# EAGLE design The_X_Project (EAGLE 6.1)
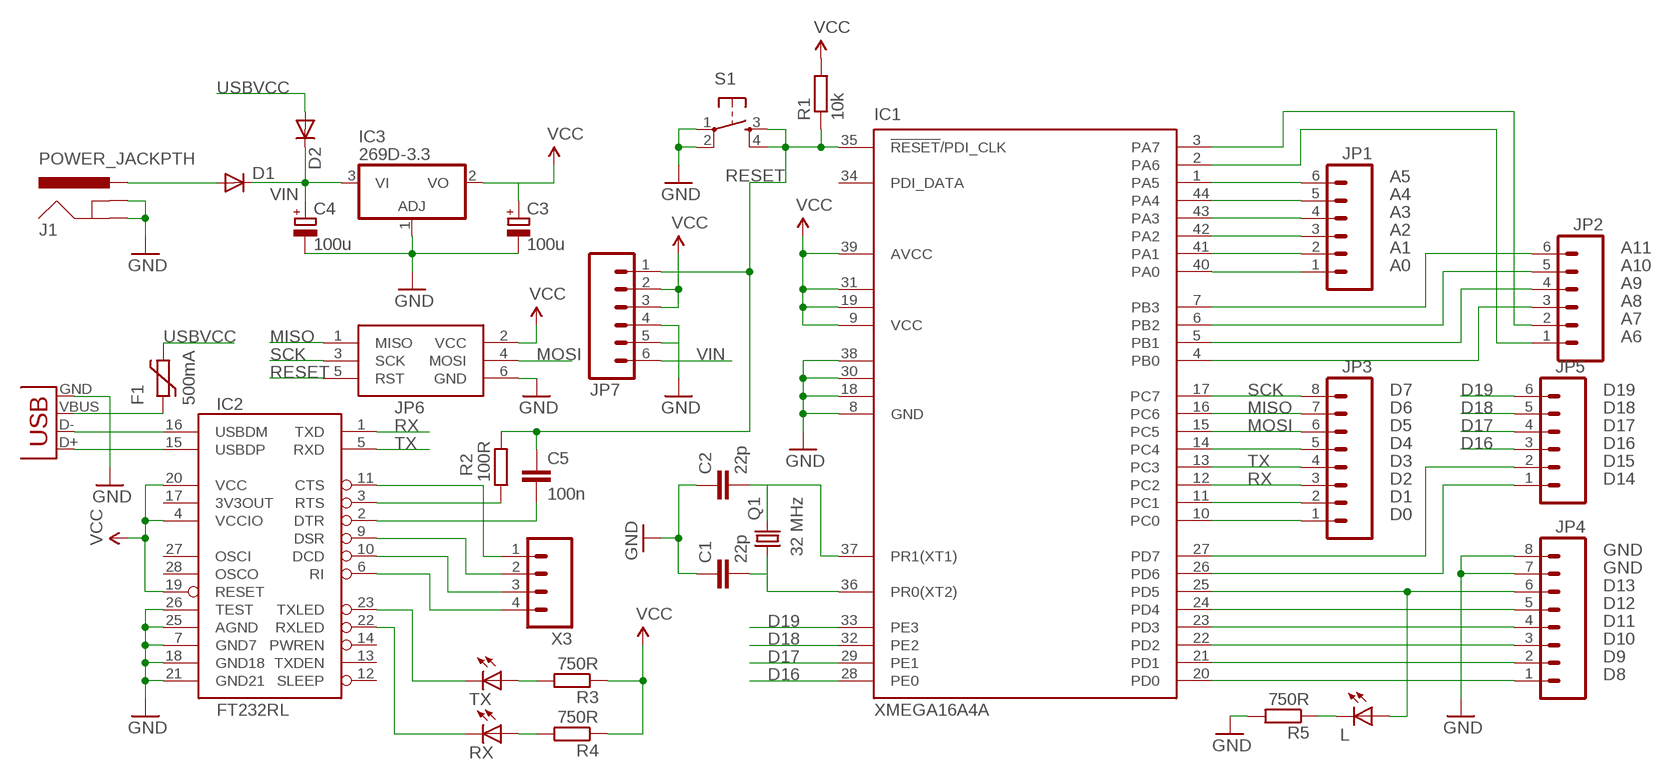
[diagram p0: schematic, sheet 1]

## Parts
C1  22p  C-EUC0805  [C0805]
C2  22p  C-EUC0805  [C0805]
C3  100u  CPOL-EUD  [PANASONIC_D]
C4  100u  CPOL-EUD  [PANASONIC_D]
C5  100n  C-EUC0805  [C0805]
D1  DIODE-SMB  [SMB]
D2  DIODE-SMB  [SMB]
F1  500mA  1812L  [1812L]
IC1  XMEGA16A4A  [TQFP44]
IC2  FT232RL  FT232RLSSOP  [SSOP28DB]
IC3  269D-3.3  MC33269D-3.3  [DPACK]
J1  POWER_JACKPTH  [POWER_JACK_PTH]
JP1  M06SIP  [1X06]
JP2  M06SIP  [1X06]
JP3  M08  [1X08]
JP4  M08  [1X08]
JP5  M06SIP  [1X06]
JP6  AVRISP-6  [AVRISP]
JP7  M06SIP  [1X06]
L  LED1206  [LED-1206]
Q1  32 MHz  CRYSTALHC49U-LM  [HC49U-LM]
R1  10k  R-EU_R0805  [R0805]
R2  100R  R-EU_R0805  [R0805]
R3  750R  R-EU_R0805  [R0805]
R4  750R  R-EU_R0805  [R0805]
R5  750R  R-EU_R0805  [R0805]
RX  LED1206  [LED-1206]
S1  TAC_SWITCHPTH  [TACTILE-PTH]
TX  LED1206  [LED-1206]
X1  USBSMD  [USB-MINIB]
X3  M04PTH  [1X04]

## Nets
D16: IC1.28(PE0) JP5.3
D17: IC1.29(PE1) JP5.4
D18: IC1.32(PE2) JP5.5
D19: IC1.33(PE3) JP5.6
GND: C1.1 C2.1 C3.- C4.- IC1.8(GND) IC1.18(GND1) IC1.30(GND2) IC1.38(GND3) IC2.7(GND7) IC2.18(GND18) IC2.21(GND21) IC2.25(AGND) IC2.26(TEST) IC3.1(ADJ) J1.GND J1.GNDBREAK JP4.7 JP4.8 JP6.6(GND) JP7.4 JP7.5 R5.2 S1.1 S1.2 X1.GND
MISO: IC1.16(PC6) JP3.7 JP6.1(MISO)
MOSI: IC1.15(PC5) JP3.6 JP6.4(MOSI)
N$1: IC1.4(PB0) JP2.3
N$2: IC1.41(PA1) JP1.2
N$3: IC1.42(PA2) JP1.3
N$4: IC1.43(PA3) JP1.4
N$5: IC1.44(PA4) JP1.5
N$6: IC1.1(PA5) JP1.6
N$7: IC1.2(PA6) JP2.1
N$8: IC1.3(PA7) JP2.2
N$9: IC1.5(PB1) JP2.4
N$10: IC1.6(PB2) JP2.5
N$11: IC1.7(PB3) JP2.6
N$12: IC1.10(PC0) JP3.1
N$13: IC1.11(PC1) JP3.2
N$14: IC2.15(USBDP) X1.D+
N$15: IC2.16(USBDM) X1.D-
N$16: IC1.14(PC4) JP3.5
N$20: IC1.20(PD0) JP4.1
N$21: IC1.21(PD1) JP4.2
N$22: IC1.22(PD2) JP4.3
N$23: IC1.23(PD3) JP4.4
N$24: IC1.24(PD4) JP4.5
N$25: IC1.25(PD5) JP4.6 L.A
N$26: IC1.26(PD6) JP5.1
N$27: IC1.27(PD7) JP5.2
N$29: IC1.40(PA0) JP1.1
N$30: D1.A J1.PWR
N$31: F1.P$1 X1.VBUS
N$32: C1.2 IC1.36(PR0(XT2)) Q1.1
N$33: C2.2 IC1.37(PR1(XT1)) Q1.2
N$34: IC2.3(RTS) R2.1
N$36: C5.2 IC2.2(DTR)
N$37: IC2.6(RI) X3.4
N$38: IC2.10(DCD) X3.3
N$39: IC2.9(DSR) X3.2
N$40: IC2.11(CTS) X3.1
N$41: IC2.22(RXLED) RX.C
N$42: IC2.23(TXLED) TX.C
N$43: R4.2 RX.A
N$44: R3.2 TX.A
N$45: L.C R5.1
RESET: C5.1 IC1.35(!RESET!/PDI_CLK) JP6.5(RST) JP7.1 R1.1 R2.2 S1.3 S1.4
RX: IC1.12(PC2) IC2.1(TXD) JP3.3
SCK: IC1.17(PC7) JP3.8 JP6.3(SCK)
TX: IC1.13(PC3) IC2.5(RXD) JP3.4
USBVCC: D2.A F1.P$2
VCC: C3.+ IC1.9(VCC) IC1.19(VCC1) IC1.31(VCC2) IC1.39(AVCC) IC2.4(VCCIO) IC2.19(RESET) IC2.20(VCC) IC3.2(VO) JP6.2(VCC) JP7.2 JP7.3 R1.2 R3.1 R4.1
VIN: C4.+ D1.C D2.C IC3.3(VI) JP7.6
Unconnected: IC1.34(PDI_DATA) IC2.12(SLEEP) IC2.13(TXDEN) IC2.14(PWREN) IC2.17(3V3OUT) IC2.27(OSCI) IC2.28(OSCO)

## Notes on the sheet
- A5
- A4
- A3
- A2
- A1 | A11
- A0 | A10
- A9
- A8
- A7
- A6
- D7 | D19
- D6 | D18
- D5 | D17
- D4 | D16
- D3 | D15
- D2 | D14
- D1
- D0
- GND
- GND
- D13
- D12
- D11
- D10
- D9
- D8

## Library data of the parts
C1 C2 C5 = rcl:C-EU: CAPACITOR, European symbol
C3 C4 = rcl:CPOL-EU: POLARIZED CAPACITOR, European symbol
D1 D2 = diode:DIODE-: DIODE
F1 = ptc-littlefuse:1812L
IC1 = atmel:XMEGA16A4: MICROCONTROLLER Features High-performance, Low-power 8/16-bit AVR XMEGA Microcontroller Non-Volatile Program and Data Memories - 16 KB - 128 KB of In-System Self-Programmable Flash - 4 KB - 8 KB Boot Code Section with Independent Lock Bits - 1 KB - 2 KB EEPROM - 2 KB - 8 KB Internal SRAM Peripheral Features - Four-channel DMA Controller with support for external requests - Eight-channel Event System - Five 16-bit Timer/Counters Three Timer/Counters with 4 Output Compare or Input Capture channels Two Timer/Counters with 2 Output Compare or Input Capture channels High-Resolution Extensions on all Timer/Counters Advanced Waveform Extension on one Timer/Counter - Five USARTs IrDA Extension on one USART - Two Two-Wire Interfaces with dual address match (I2C and SMBus compatible) - Two SPIs (Serial Peripheral Interfaces) peripherals - AES and DES Crypto Engine - 16-bit Real Time Counter with Separate Oscillator - One Twelve-channel, 12-bit, 2 Msps Analog to Digital Converter - One Two-channel, 12-bit, 1 Msps Digital to Analog Converter - Two Analog Comparators with Window compare function - External Interrupts on all General Purpose I/O pins - Programmable Watchdog Timer with Separate On-chip Ultra Low Power Oscillator Special Microcontroller Features - Power-on Reset and Programmable Brown-out Detection - Internal and External Clock Options with PLL - Programmable Multi-level Interrupt Controller - Sleep Modes: Idle, Power-down, Standby, Power-save, Extended Standby - Advanced Programming, Test and Debugging Interfaces PDI (Program and Debug Interface) for programming, test and debugging I/O and Packages - 34 Programmable I/O Lines - 44 - lead TQFP - 44 - pad VQFN/QFN - 49 - ball VFBGA Operating Voltage - 1.6 - 3.6V Speed performance - 0 - 12 MHz @ 1.6 - 3.6V - 0 - 32 MHz @ 2.7 - 3.6V Drawn by Dipl.-Ing. (FH) Robert Siegler Created: 27.05.09; OC_FARNELL: unknown; OC_NEWARK: unknown
IC2 = SparkFun:FT232RL: USB UART FT232RL 4th Generation USB UART (USB <-> Serial) Controller. Spark Fun Electronics SKU : COM-00650
IC3 = linear:MC33269?*: Adjustable Output Low Dropout Voltage Regulator 800 mA Source: http://www.onsemi.com/pub/Collateral/MC33269-D.PDF
J1 = SparkFun:POWER_JACK: Power Jack This is the standard 5.5mm barrel jack for power. The PTH is the most common, proven, reliable, footprint. All others are experimental. The Slot footprint only works if the mill layer is transmitted to the PCB fab house so be warned. Spark Fun Electronics SKU : PRT-00119. Mating wall wart : TOL-00298 (and others)
JP1 JP2 JP5 JP7 = SparkFun:M06: Header 6 Standard 6-pin 0.1" header. Use with straight break away headers (SKU : PRT-00116), right angle break away headers (PRT-00553), swiss pins (PRT-00743), machine pins (PRT-00117), and female headers (PRT-00115). Molex polarized connector foot print use with SKU : PRT-08094 with associated crimp pins and housings. NOTES ON THE VARIANTS LOCK and LOCK_LONGPADS... This footprint was designed to help hold the alignment of a through-hole component (i.e. 6-pin header) while soldering it into place. You may notice that each hole has been shifted either up or down by 0.005 of an inch from it's more standard position (which is a perfectly straight line). This slight alteration caused the pins (the squares in the middle) to touch the edges of the holes. Because they are alternating, it causes a "brace" to hold the component in place. 0.005 has proven to be the perfect amount of "off-center" position when using our standard breakaway headers. Although looks a little odd when you look at the bare footprint, once you have a header in there, the alteration is very hard to notice. Also, if you push a header all the way into place, it is covered up entirely on the bottom side. This idea of altering the position of holes to aid alignment will be further integrated into the Sparkfun Library for other footprints. It can help hold any component with 3 or more connection pins.
JP3 JP4 = SparkFun:M08: Header 8 Standard 8-pin 0.1" header. Use with straight break away headers (SKU : PRT-00116), right angle break away headers (PRT-00553), swiss pins (PRT-00743), machine pins (PRT-00117), and female headers (PRT-00115).
JP6 = adafruit:AVRISP: AVR ISP HEADER Standard 6 pin header for AVR programming
L RX TX = SparkFun:LED: LEDs Standard schematic elements and footprints for 5mm, 3mm, 1206, and 0603 sized LEDs. 5mm - Spark Fun Electronics SKU : COM-00529 (and others)
Q1 = crystal:CRYSTAL: CRYSTAL; OC_FARNELL: 1666956; OC_NEWARK: unknown
R1-R5 = rcl:R-EU_: RESISTOR, European symbol
S1 = SparkFun:TAC_SWITCH: Momentary Switch Button commonly used for reset or general input. Spark Fun Electronics SKU : COM-00097
X1 = SparkFun:USB: USB Connectors USB-B-PTH is fully proven SKU : PRT-00139 USB-miniB is fully proven SKU : PRT-00587 USB-A-PCB is untested. USB-A-H is throughly reviewed, but untested. Spark Fun Electronics SKU : PRT-00437 USB-B-SMT is throughly reviewed, but untested. Needs silkscreen touching up. USB-A-S has not been used/tested USB-MB-H has not been used/tested
X3 = SparkFun:M04: Header 4 Standard 4-pin 0.1" header. Use with straight break away headers (SKU : PRT-00116), right angle break away headers (PRT-00553), swiss pins (PRT-00743), machine pins (PRT-00117), and female headers (PRT-00115). Molex polarized connector foot print use with SKU : PRT-08231 with associated crimp pins and housings.

## Board
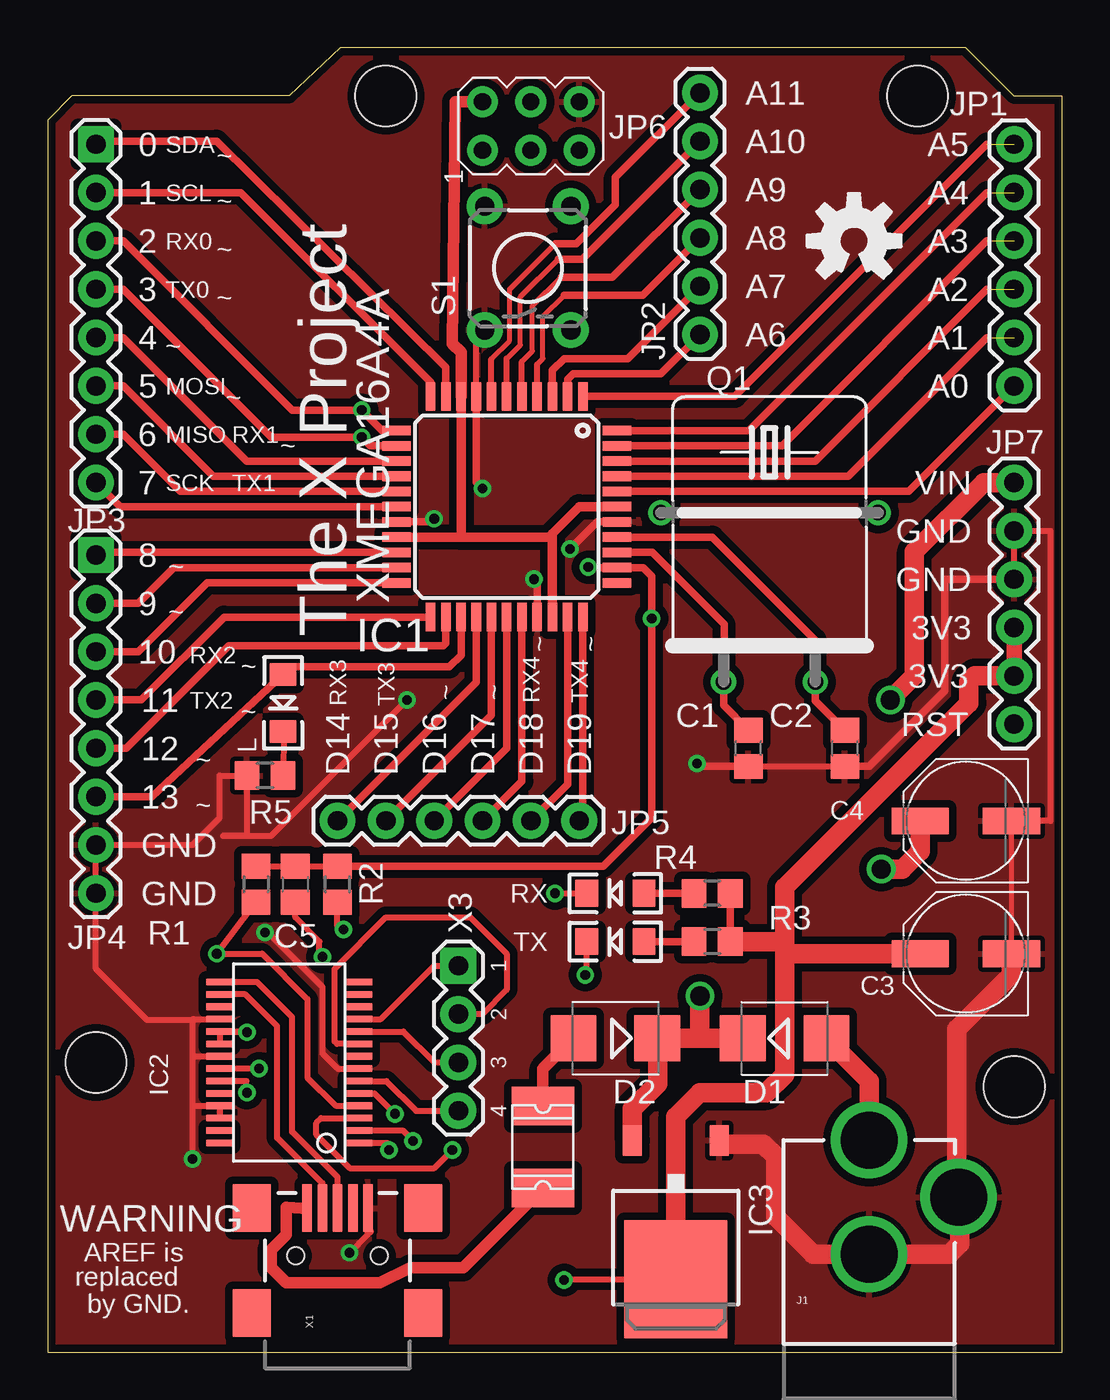
[diagram p1: board, top side]
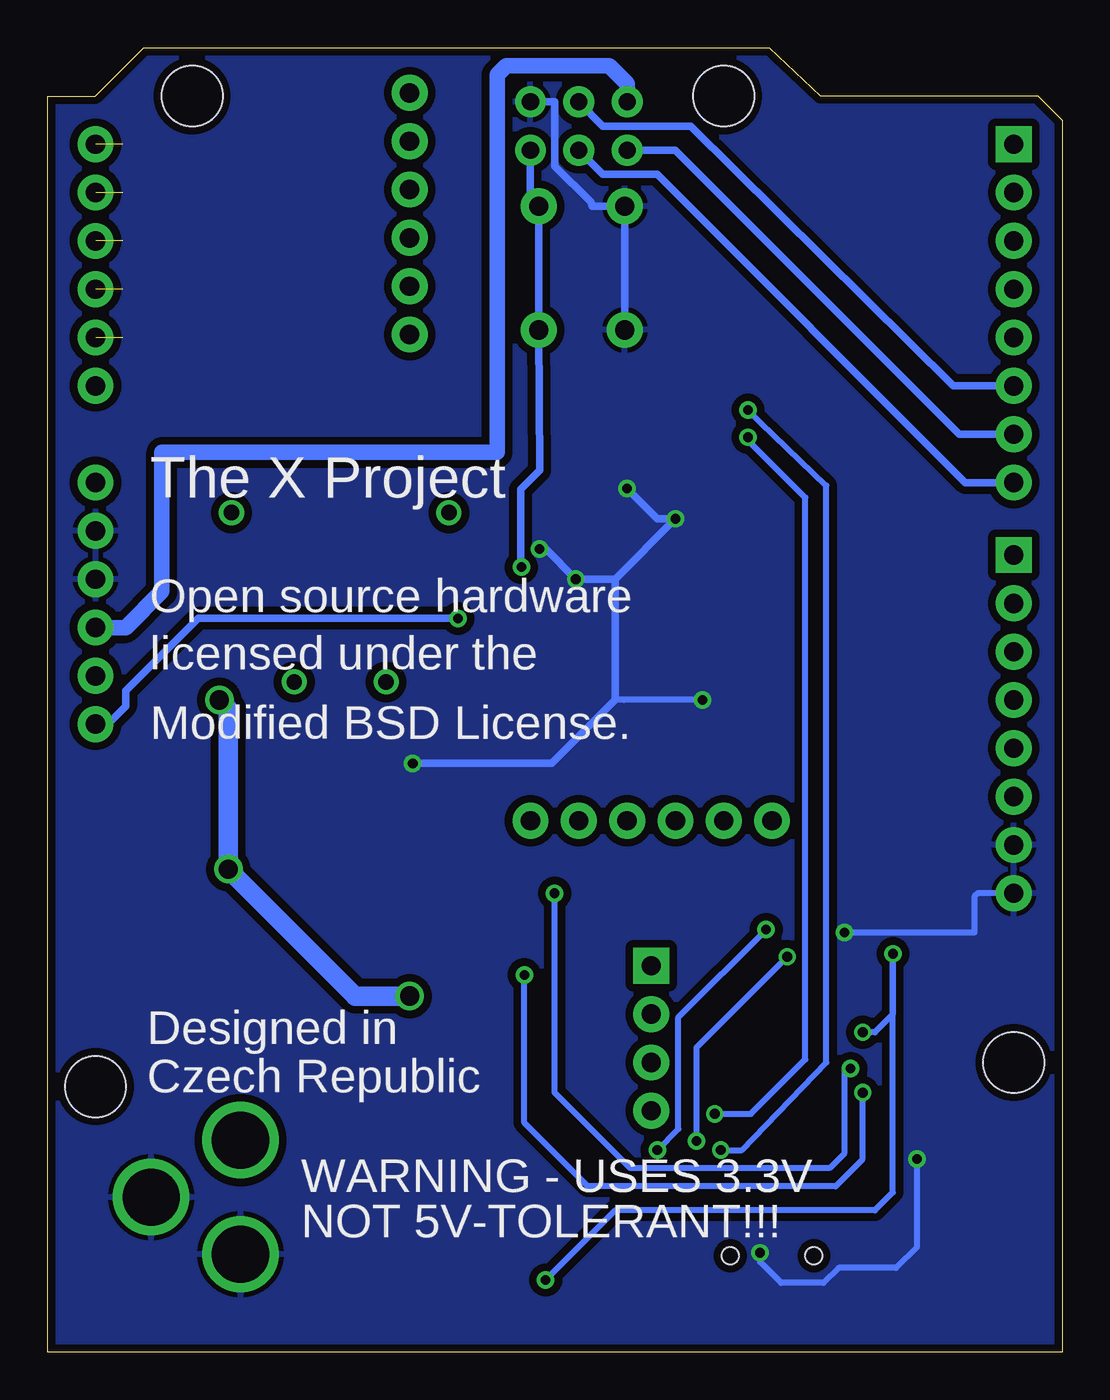
[diagram p2: board, bottom side, seen from below]

Size 53.32 x 68.58 mm. Coordinates in mm from the lower left corner, seen from the top.
Outline: 0,0 53.32,0 53.32,66.03 50.81,66.03 48.26,68.58 15.39,68.57 12.7,66.04 1.27,66.04 0,64.77 0,0
Copper layers (1*16): Top 0.035mm / dielectric 1.5mm / Bottom 0.035mm
Design rules: minimum track width 10mil, minimum drill 20mil, track to track 8mil, track to pad 8mil, pad to pad 8mil, via to via 8mil, smd to smd 8mil, copper to edge 10mil, drill to drill 8mil, minimum pad ring 10mil, minimum via ring 8mil, stop-mask expansion 4mil, vias tented up to drill 0mil, thermal gap 10mil
Holes 3.2 mm at 2.54,15.24 50.8,13.97 17.78,66.04 45.72,66.04

### Footprints (pad centres in the part's own frame; a part is rotated, then mirrored left to right if it is on the bottom)
C0805 = smd 1.3 x 1.5: 1 -0.95,0; 2 0.95,0
PANASONIC_D = smd 3 x 1.4: + 2.4,0; - -2.4,0
SMB = smd 2.4 x 2.4: A 2.2,0; C -2.2,0
1812L = smd 2.03 x 3.3: P$1 -2.16,0; P$2 2.16,0
TQFP44 = smd 1.5 x 0.5: 1 -5.8,4; 2 -5.8,3.2; 3 -5.8,2.4; 4 -5.8,1.6; 5 -5.8,0.8; 6 -5.8,0; 7 -5.8,-0.8; 8 -5.8,-1.6; 9 -5.8,-2.4; 10 -5.8,-3.2; 11 -5.8,-4; 23 5.8,-4; 24 5.8,-3.2; 25 5.8,-2.4; 26 5.8,-1.6; 27 5.8,-0.8; 28 5.8,0; 29 5.8,0.8; 30 5.8,1.6; 31 5.8,2.4; 32 5.8,3.2; 33 5.8,4 | smd 0.5 x 1.5: 12 -4,-5.8; 13 -3.2,-5.8; 14 -2.4,-5.8; 15 -1.6,-5.8; 16 -0.8,-5.8; 17 0,-5.8; 18 0.8,-5.8; 19 1.6,-5.8; 20 2.4,-5.8; 21 3.2,-5.8; 22 4,-5.8; 34 4,5.8; 35 3.2,5.8; 36 2.4,5.8; 37 1.6,5.8; 38 0.8,5.8; 39 0,5.8; 40 -0.8,5.8; 41 -1.6,5.8; 42 -2.4,5.8; 43 -3.2,5.8; 44 -4,5.8
SSOP28DB = smd 0.348 x 1.397: 1 -4.225,-3.656; 2 -3.575,-3.656; 3 -2.925,-3.656; 4 -2.275,-3.656; 5 -1.625,-3.656; 6 -0.975,-3.656; 7 -0.325,-3.656; 8 0.325,-3.656; 9 0.975,-3.656; 10 1.625,-3.656; 11 2.275,-3.656; 12 2.925,-3.656; 13 3.575,-3.656; 14 4.225,-3.656; 15 4.225,3.656; 16 3.575,3.656; 17 2.925,3.656; 18 2.275,3.656; 19 1.625,3.656; 20 0.975,3.656; 21 0.325,3.656; 22 -0.325,3.656; 23 -0.975,3.656; 24 -1.625,3.656; 25 -2.275,3.656; 26 -2.925,3.656; 27 -3.575,3.656; 28 -4.225,3.656
DPACK = smd 1 x 1.6: 1 -2.28,-4.8; 3 2.28,-4.8 | smd 5.4 x 6.2: 2 0,2.5
POWER_JACK_PTH = drill 2.997: GND 0,7.7; GNDBREAK 4.7,10.7; PWR 0,13.7
1X06 = drill 1.016 pad 1.88: 1 0,0; 2 2.54,0; 3 5.08,0; 4 7.62,0; 5 10.16,0; 6 12.7,0
1X08 = drill 1.016 pad 1.88 square: 1 0,0 | drill 1.016 pad 1.88: 2 2.54,0; 3 5.08,0; 4 7.62,0; 5 10.16,0; 6 12.7,0; 7 15.24,0; 8 17.78,0
AVRISP = drill 0.9 pad 1.626: 1 -1.27,2.54; 2 1.27,2.54; 3 -1.27,0; 4 1.27,0; 5 -1.27,-2.54; 6 1.27,-2.54
LED-1206 = smd 1.2 x 1.4: A -1.5,0; C 1.5,0
HC49U-LM = drill 0.813: 1 -2.413,-5.08; 2 2.413,-5.08; M -5.715,3.81; M1 5.715,3.81
R0805 = smd 1.3 x 1.5: 1 -0.95,0; 2 0.95,0
TACTILE-PTH = drill 1.016 pad 1.88: 1 -3.251,2.261; 2 3.251,2.261; 3 -3.251,-2.261; 4 3.251,-2.261
USB-MINIB = smd 2.5 x 0.5: D+ 2.5,0; D- 2.5,0.8; GND 2.5,-1.6; ID 2.5,-0.8; VBUS 2.5,1.6 | smd 2.5 x 2: GND@1 -3,-4.5; GND@2 -3,4.5; GND@3 2.5,4.5; GND@4 2.5,-4.5 | hole 0.9: 0,2.2; 0,-2.2
1X04 = drill 1.016 pad 1.88 square: 1 0,0 | drill 1.016 pad 1.88: 2 2.54,0; 3 5.08,0; 4 7.62,0

### Placement (x,y rotation side)
C1  36.83,31.75 90 top
C2  41.91,31.75 90 top
C3  48.26,20.95 180 top
C4  48.26,27.94 180 top
C5  13.02,24.61 270 top
D1  38.74,16.51 0 top
D2  29.85,16.51 180 top
F1  26.04,10.79 90 top
IC1  24.13,44.45 270 top
IC2  12.7,15.24 90 top
IC3  33.02,6.35 180 top
J1  43.18,-2.54 0 top
JP1  50.8,50.8 90 top
JP2  34.29,53.5 90 top
JP3  2.54,63.5 270 top
JP4  2.54,41.91 270 top
JP5  15.24,27.94 0 top
JP6  25.4,64.45 90 top
JP7  50.8,33.02 90 top
L  12.38,34.13 270 top
Q1  37.94,40.32 0 top
R1  10.95,24.61 270 top
R2  15.24,24.61 90 top
R3  34.93,21.59 180 top
R4  34.93,24.13 180 top
R5  11.43,30.32 180 top
RX  29.85,24.13 180 top
S1  25.24,56.99 90 top
TX  29.85,21.59 180 top
U$1  [OSHW-LOGO-M]  42.39,58.42 0 top
X1  15.24,5.08 90 top
X3  21.59,20.32 270 top

### Tracks (layer width: path | path; a pad name or v marks a point on that pad's centre or on a via)
D16
  Top 0.406: IC1.28 24.13,31.75 JP5.3
D17
  Top 0.406: IC1.29 24.93,30.01 JP5.4
D18
  Top 0.406: IC1.32 27.33,29.87 JP5.5
D19
  Top 0.406: IC1.33 28.13,28.13 JP5.6
GND  (via drill 0.51)
  Top 0.254: C4.- C3.-
  Top 0.305: IC2.26 IC2.25 7.67,12.96 | 7.67,12.96 7.62,13.02 7.62,15.56 | 7.62,15.56 IC2.21 7.63,15.56 7.62,15.56 | 7.62,15.56 7.62,17.46 | IC2.18 7.67,17.52 7.62,17.46 | 7.62,17.46 5.24,17.46 2.54,20.16 JP4.8 JP4.7 7.62,26.67 9.05,28.1 9.05,30.32 R5.2 10.48,27.14 9.21,27.15 11.75,27.15 v18.89,34.29 | 16.84,6.2 X1.GND | v15.87,5.24 16.84,6.2 | v7.62,10.16 7.62,12.96 7.67,12.96 | 16.84,6.2 16.99,6.35 | IC2.7 15.25,14.91 14.45,15.72 14.45,19.21 11.75,21.91 v11.43,22.07 | C1.1 C2.1 | IC1.8 22.53,53.45 S1.1 | C4.- 52.71,27.94 52.71,43.18 JP7.5 JP7.4
  Top 0.406: IC1.38 28.89,43.65 v27.46,42.23 | IC1.30 25.73,40.47 v25.56,40.64 | IC1.8 22.53,45.73 v22.86,45.4 | IC1.18 20.15,43.65 v20.32,43.81 | C1.1 34.29,30.8 v34.13,30.96 | C2.1 43.18,30.8 47.15,34.77 47.15,40.64 JP7.4
  Top 1.016: IC3.1 35.5,10.95 37.62,10.95 38.26,10.32 38.26,7.14 40.24,5.16 J1.GND 47.39,5.16 47.94,5.71 47.94,8.1 J1.GNDBREAK 47.78,8.26 47.78,16.99 50.66,19.86 C3.-
  Bottom 0.305: v15.87,5.24 15.87,4.76 14.76,3.65 12.54,3.65 11.75,4.45 8.73,4.45 7.62,5.56 v7.62,10.16 | v11.43,22.07 4.6,22.07 4.6,23.97 4.45,24.13 JP4.8 | v18.89,34.29 23.02,34.29 23.49,34.29
  Bottom 0.406: JP6.6 26.67,65.72 26.67,62.34 24.76,60.48 24.68,60.24 S1.2 S1.1 | v27.46,42.23 27.15,42.23 v25.56,40.64 23.49,40.64 | v22.86,45.4 21.27,43.81 v20.32,43.81 23.49,40.64 | 23.49,40.64 23.49,34.29 26.83,30.96 v34.13,30.96
  pour Bottom (isolate 0.406): 0.16,0.16 53.18,0.16 53.18,65.88 50.8,65.88 48.26,68.42 15.4,68.42 12.7,65.88 1.27,65.88 0.16,64.77
  pour Top (isolate 0.406): 0.16,0.16 53.18,0.16 53.18,65.88 50.8,65.88 48.26,68.42 15.4,68.42 12.7,65.88 1.27,65.88 0.16,64.77
MISO
  Top 0.406: IC1.16 6.98,45.25 3.97,48.26 JP3.7
  Bottom 0.406: JP6.1 20.32,63.18 5.4,48.26 JP3.7
MOSI
  Top 0.406: IC1.15 8.72,46.05 3.97,50.8 JP3.6
  Bottom 0.406: JP6.4 24.13,64.45 19.53,64.45 5.71,50.8 JP3.6
N$1
  Top 0.254: 25.73,51.92 26.04,52.23 26.04,54.45 27.15,55.56
  Top 0.305: IC1.4 25.73,51.92
  Top 0.406: 27.15,55.56 31.27,55.56 JP2.3
N$2  (1 unrouted)
  Top 0.406: IC1.41 42.08,46.05 49.37,53.34
N$3  (1 unrouted)
  Top 0.406: IC1.42 40.34,46.85 49.37,55.88
N$4  (1 unrouted)
  Top 0.406: IC1.43 38.6,47.65 49.37,58.42
N$5  (1 unrouted)
  Top 0.406: IC1.44 36.86,48.45 49.37,60.96
N$6  (1 unrouted)
  Top 0.406: IC1.1 36.12,50.25 49.37,63.5
N$7
  Top 0.406: IC1.2 27.33,51.14 27.62,51.44 32.23,51.44 JP2.1
N$8
  Top 0.406: IC1.3 26.53,51.61 27.15,52.23 30.48,52.23 JP2.2
N$9
  Top 0.254: 24.93,52.08 25.48,52.63 25.48,55.01 26.99,56.52
  Top 0.305: IC1.5 24.93,52.08
  Top 0.406: 26.99,56.52 29.69,56.52 JP2.4
N$10
  Top 0.254: 24.13,52.23 24.85,52.94 24.85,55.48 26.83,57.47
  Top 0.305: IC1.6 24.13,52.23
  Top 0.406: 26.83,57.47 28.1,57.47 JP2.5
N$11
  Top 0.254: 23.33,52.22 24.29,53.18 24.29,55.88 26.67,58.26
  Top 0.305: IC1.7 23.33,52.22
  Top 0.406: 26.67,58.26 27.78,58.26 29.85,60.33 29.85,61.75 JP2.6
N$12
  Top 0.406: IC1.10 20.93,51.78 8.89,63.66 2.7,63.66 JP3.1
N$13
  Top 0.406: IC1.11 20.13,50.99 10.16,60.96 JP3.2
N$14
  Top 0.305: X1.D+ 15.24,9.21 12.86,11.59 12.86,17.62 11.02,19.46 IC2.15
N$15
  Top 0.305: X1.D- 14.44,8.9 12.07,11.27 12.07,17.14 10.4,18.81 IC2.16
N$16
  Top 0.406: IC1.14 10.46,46.85 3.97,53.34 JP3.5
N$20
  Top 0.406: IC1.20 2.68,42.05 JP4.1
N$21
  Top 0.406: IC1.21 6.64,41.25 4.76,39.37 JP4.2
N$22
  Top 0.406: IC1.22 8.38,40.45 4.76,36.83 JP4.3
N$23
  Top 0.406: IC1.23 9.28,38.65 4.92,34.29 JP4.4
N$24
  Top 0.406: IC1.24 20.93,37.28 20.8,37.15 9.52,37.15 4.13,31.75 JP4.5
N$25
  Top 0.406: JP4.6 5.48,29.21 L.A 12.31,36.04 21.11,36.04 21.73,36.65 IC1.25
N$26
  Top 0.406: IC1.26 22.53,35.23 JP5.1
N$27
  Top 0.406: IC1.27 23.33,33.49 JP5.2
N$29
  Top 0.406: IC1.40 45.25,45.25 JP1.1
N$30
  Top 1.016: J1.PWR 43.18,14.27 D1.A
N$31
  Top 0.508: 13.37,7.58 X1.VBUS
  Top 0.61: 13.37,7.58 12.54,7.62 12.54,6.19 11.75,5.4 11.75,4.45 12.54,3.65 17.46,3.65 19.05,4.45 21.85,4.45 F1.P$1
N$32
  Top 0.406: IC1.36 31.77,42.05 35.56,38.26 35.56,35.59 Q1.1 35.53,34 C1.2
N$33
  Top 0.406: IC1.37 34.94,42.85 40.32,37.46 40.32,35.59 Q1.2 40.35,34.26 C2.2
N$34  (via drill 0.51)
  Top 0.305: IC2.3 14.38,12.31 14.13,12.06 14.13,11.43 15.87,9.68 20.32,9.68 v21.27,10.64 | R2.1 15.24,22.39 v15.56,22.22
  Bottom 0.305: v21.27,10.64 20.16,11.75 20.16,17.62 v15.56,22.22
N$36  (via drill 0.51)
  Top 0.305: IC2.2 18.66,11.66 v19.21,11.11 | v14.45,20.8 14.29,20.8 14.29,21.59 13.02,22.86 C5.2
  Bottom 0.305: v19.21,11.11 19.21,16.03 v14.45,20.8
N$37
  Top 0.305: IC2.6 17.8,14.27 19.37,12.7 X3.4
N$38
  Top 0.305: IC2.10 18.7,16.86 20.32,15.24 X3.3
N$39
  Top 0.305: IC2.9 15.22,16.21 15.08,16.35 15.08,20.16 17.78,22.86 22.23,22.86 24.13,20.95 24.13,19.05 22.86,17.78 X3.2
N$40
  Top 0.305: IC2.11 17.51,17.52 20.32,20.32 X3.1
N$41  (via drill 0.51)
  Top 0.305: IC2.22 v11.1,14.91 v11.11,14.92 | v26.67,24.13 RX.C
  Bottom 0.305: v11.11,14.92 11.43,14.92 11.43,10.48 12.22,9.68 22.7,9.68 26.67,13.65 v26.67,24.13
N$42  (via drill 0.51)
  Top 0.305: IC2.23 10.45,14.27 v10.48,13.65 | TX.C 28.35,19.93 v28.26,19.84
  Bottom 0.305: v10.48,13.65 10.48,10.16 11.91,8.73 24.92,8.73 28.26,12.06 v28.26,19.84
N$43
  Top 0.406: RX.A R4.2
N$44
  Top 0.406: TX.A R3.2
N$45
  Top 0.305: L.C 12.45,32.62 R5.1
RESET  (via drill 0.51)
  Top 0.305: R1.1 C5.1 R2.2 | 31.75,28.1 v31.75,38.58
  Top 0.406: R2.2 29.21,25.56 31.75,28.1 31.75,40.8 31.3,41.25 IC1.35 28.44,41.25 v28.42,41.27
  Bottom 0.406: JP6.5 27.94,60.84 S1.4 S1.3 27.46,46.35 28.46,45.36 28.46,41.4 v28.42,41.27 | v31.75,38.58 45.4,38.58 49.21,34.77 49.21,33.97 50.16,33.02 JP7.1
RX  (via drill 0.51)
  Top 0.305: IC2.1 17.88,11.02 v17.94,10.64 | v16.51,49.53
  Top 0.406: IC1.12 17.59,48.45 v16.51,49.53 12.86,49.53 3.97,58.42 JP3.3
  Bottom 0.305: v17.94,10.64 16.83,10.64 12.38,15.24 12.38,45.56 v16.51,49.53
SCK
  Top 0.406: IC1.17 3.81,44.45 JP3.8
  Bottom 0.406: JP6.3 24.13,61.91 22.7,61.91 21.27,61.91 5.08,45.72 JP3.8
TX  (via drill 0.51)
  Top 0.305: IC2.5 17.18,13.61 v18.26,12.54 | v18.26,12.54
  Top 0.406: IC1.13 16.96,47.65 v16.51,48.1 11.75,48.1 3.97,55.88 JP3.4
  Bottom 0.305: v18.26,12.54 16.35,12.54 13.49,15.4 13.49,44.93 16.51,47.94 v16.51,48.1
USBVCC
  Top 0.61: F1.P$2 26.04,14.9 D2.A
VCC  (via drill 0.51)
  Top 0.305: R1.2 v8.89,20.95 11.27,20.95 13.65,18.57 13.65,14.45 15.13,12.96 IC2.4 | IC3.2 27.19,3.85 v27.15,3.81 | IC2.19 IC2.20 9.04,16.82 9.05,16.83 v10.48,16.83 10.44,16.86 IC2.19
  Top 0.406: R3.1 R4.1
  Top 0.508: IC1.39 27.94,44.45 26.53,43.04 | 26.53,43.04 IC1.31 | 21.59,42.85 IC1.19 | 21.59,42.85 26.34,42.85 26.53,43.04 | IC1.9 21.73,42.99 21.59,42.85
  Top 0.61: IC1.9 21.73,52.56 21.27,53.02 21.43,65.72 JP6.2
  Top 0.813: JP7.2 JP7.3
  Top 1.016: IC3.2 33.02,12.38 34.29,13.65 37.78,13.65 38.74,14.61 38.74,20.8 | 38.74,21.59 R3.1 | 38.74,20.8 | 38.74,20.8 38.74,20.95 | 38.74,20.8 38.74,21.59 | 38.74,20.95 C3.+ | 38.74,20.95 38.74,21.59 | 38.74,21.59 38.74,24.45 48.42,34.13 48.42,35.24 48.74,35.56 JP7.2
  Bottom 0.305: v10.48,16.83 9.84,16.83 8.89,17.78 v8.89,20.95 8.89,8.41 9.84,7.46 23.49,7.46 v27.15,3.81
  Bottom 0.813: JP6.2 22.86,66.67 23.81,67.63 29.21,67.63 29.69,67.15 29.69,47.31 47.31,47.31 47.31,40.01 49.21,38.1 JP7.3
VIN  (via drill 1)
  Top 1.016: IC3.3 30.74,12.8 32.07,14.13 32.07,16.49 D2.C 34.29,16.51 | 34.29,16.51 D1.C | 34.29,16.51 v34.29,18.73 | C4.+ 45.86,26.33 44.93,25.4 v43.82,25.4 | JP7.6 49.21,45.72 45.56,42.07 45.56,35.56 v44.29,34.29
  Bottom 1.016: v34.29,18.73 37.15,18.73 v43.82,25.4 43.82,33.81 v44.29,34.29

### Text on the board
tPlace: A11 | A5 | 0 | SDA | A10 | ~ | A4 | 1 | SCL | ~ | A9 | A3 | 2 | RX0 | A8 | ~ | A2 | 3 | TX0 | ~ | A7 | A1 | 4 | A6 | ~ | A0 | 5 | MOSI | ~ | 6 | MISO | RX1 | ~ | VIN | 7 | SCK | TX1 | GND | 8 | ~ | GND | 9 | 3V3 | ~ | The X Project | ~ | ~ | 10 | RX2 | 3V3 | ~ | 11 | TX2 | RX3 | TX3 | ~ | ~ | RX4 | TX4 | RST | ~ | 12 | ~ | D14 | D15 | D16 | D17 | D18 | D19 | 13 | ~ | GND | GND | 1 | 2 | 3 | 4 | WARNING | AREF is | replaced | by GND.
bPlace: The X Project | Open source hardware | licensed under the | Modified BSD License. | Designed in | Czech Republic | WARNING - USES 3.3V | NOT 5V-TOLERANT!!!